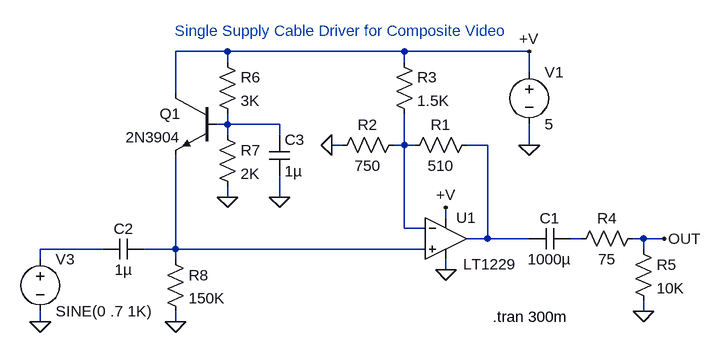
[diagram p0: schematic 1229.asc]
1229.asc, the LTspice schematic file:
Version 4
SHEET 1 1260 680
WIRE -48 -48 -128 -48
WIRE 224 -48 -48 -48
WIRE 416 -48 224 -48
WIRE -48 -32 -48 -48
WIRE 224 -32 224 -48
WIRE 416 -16 416 -48
WIRE -128 16 -128 -48
WIRE -48 64 -48 48
WIRE -48 64 -64 64
WIRE 32 64 -48 64
WIRE -48 80 -48 64
WIRE 32 80 32 64
WIRE 128 96 112 96
WIRE 224 96 224 48
WIRE 224 96 208 96
WIRE 240 96 224 96
WIRE 352 96 320 96
WIRE 416 96 416 64
WIRE -48 176 -48 160
WIRE 32 176 32 144
WIRE 288 208 288 192
WIRE 224 224 224 96
WIRE 256 224 224 224
WIRE 352 240 352 96
WIRE 352 240 320 240
WIRE 416 240 352 240
WIRE 496 240 480 240
WIRE 592 240 576 240
WIRE 624 240 592 240
WIRE -240 256 -336 256
WIRE -128 256 -128 112
WIRE -128 256 -176 256
WIRE 256 256 -128 256
WIRE 592 256 592 240
WIRE -336 272 -336 256
WIRE -128 272 -128 256
WIRE 288 288 288 272
WIRE 592 352 592 336
WIRE -336 368 -336 352
WIRE -128 368 -128 352
FLAG 416 96 0
FLAG 288 192 +V
FLAG 416 -48 +V
FLAG 112 96 0
FLAG -336 368 0
FLAG 288 288 0
FLAG 592 352 0
FLAG 624 240 OUT
FLAG -48 176 0
FLAG -128 368 0
FLAG 32 176 0
SYMBOL voltage 416 -32 R0
SYMATTR InstName V1
SYMATTR Value 5
SYMBOL res 336 80 R90
WINDOW 0 0 56 VBottom 2
WINDOW 3 32 56 VTop 2
SYMATTR InstName R1
SYMATTR Value 510
SYMBOL res 224 80 R90
WINDOW 0 0 56 VBottom 2
WINDOW 3 32 56 VTop 2
SYMATTR InstName R2
SYMATTR Value 750
SYMBOL voltage -336 256 R0
SYMATTR InstName V3
SYMATTR Value SINE(0 .7 1K)
SYMBOL opamps\\LT1229 288 176 R0
WINDOW 3 27 103 Left 2
SYMATTR InstName U1
SYMBOL res 208 -48 R0
SYMATTR InstName R3
SYMATTR Value 1.5K
SYMBOL cap 480 224 R90
WINDOW 0 0 32 VBottom 2
WINDOW 3 32 32 VTop 2
SYMATTR InstName C1
SYMATTR Value 1000µ
SYMBOL res 480 256 R270
WINDOW 0 32 56 VTop 2
WINDOW 3 0 56 VBottom 2
SYMATTR InstName R4
SYMATTR Value 75
SYMBOL res 576 240 R0
SYMATTR InstName R5
SYMATTR Value 10K
SYMBOL npn -64 16 M0
SYMATTR InstName Q1
SYMATTR Value 2N3904
SYMBOL res -64 -48 R0
SYMATTR InstName R6
SYMATTR Value 3K
SYMBOL res -64 64 R0
SYMATTR InstName R7
SYMATTR Value 2K
SYMBOL res -144 256 R0
SYMATTR InstName R8
SYMATTR Value 150K
SYMBOL cap -176 240 R90
WINDOW 0 0 32 VBottom 2
WINDOW 3 32 32 VTop 2
SYMATTR InstName C2
SYMATTR Value 1µ
SYMBOL cap 16 80 R0
SYMATTR InstName C3
SYMATTR Value 1µ
TEXT 360 360 Left 2 !.tran 300m
TEXT 128 -64 Bottom 2 ;Single Supply Cable Driver for Composite Video

The netlist it stands for:
* 1229.asc
V1 +V 0 5
R1 N003 N002 510
R2 N002 0 750
V3 N005 0 SINE(0 .7 1K)
XU1 N006 N002 +V 0 N003 LT1229  ; pins In+ In- V+ V- OUT
R3 +V N002 1.5K
C1 N004 N003 1000µ
R4 N004 OUT 75
R5 OUT 0 10K
Q1 +V N001 N006 0 2N3904
R6 +V N001 3K
R7 N001 0 2K
R8 N006 0 150K
C2 N006 N005 1µ
C3 N001 0 1µ
.model NPN NPN
.model PNP PNP
.lib standard.bjt
.tran 300m
* Single Supply Cable Driver for Composite Video
.backanno
.end